# EAGLE design Optical Lick Detector (EAGLE 9.3.2)
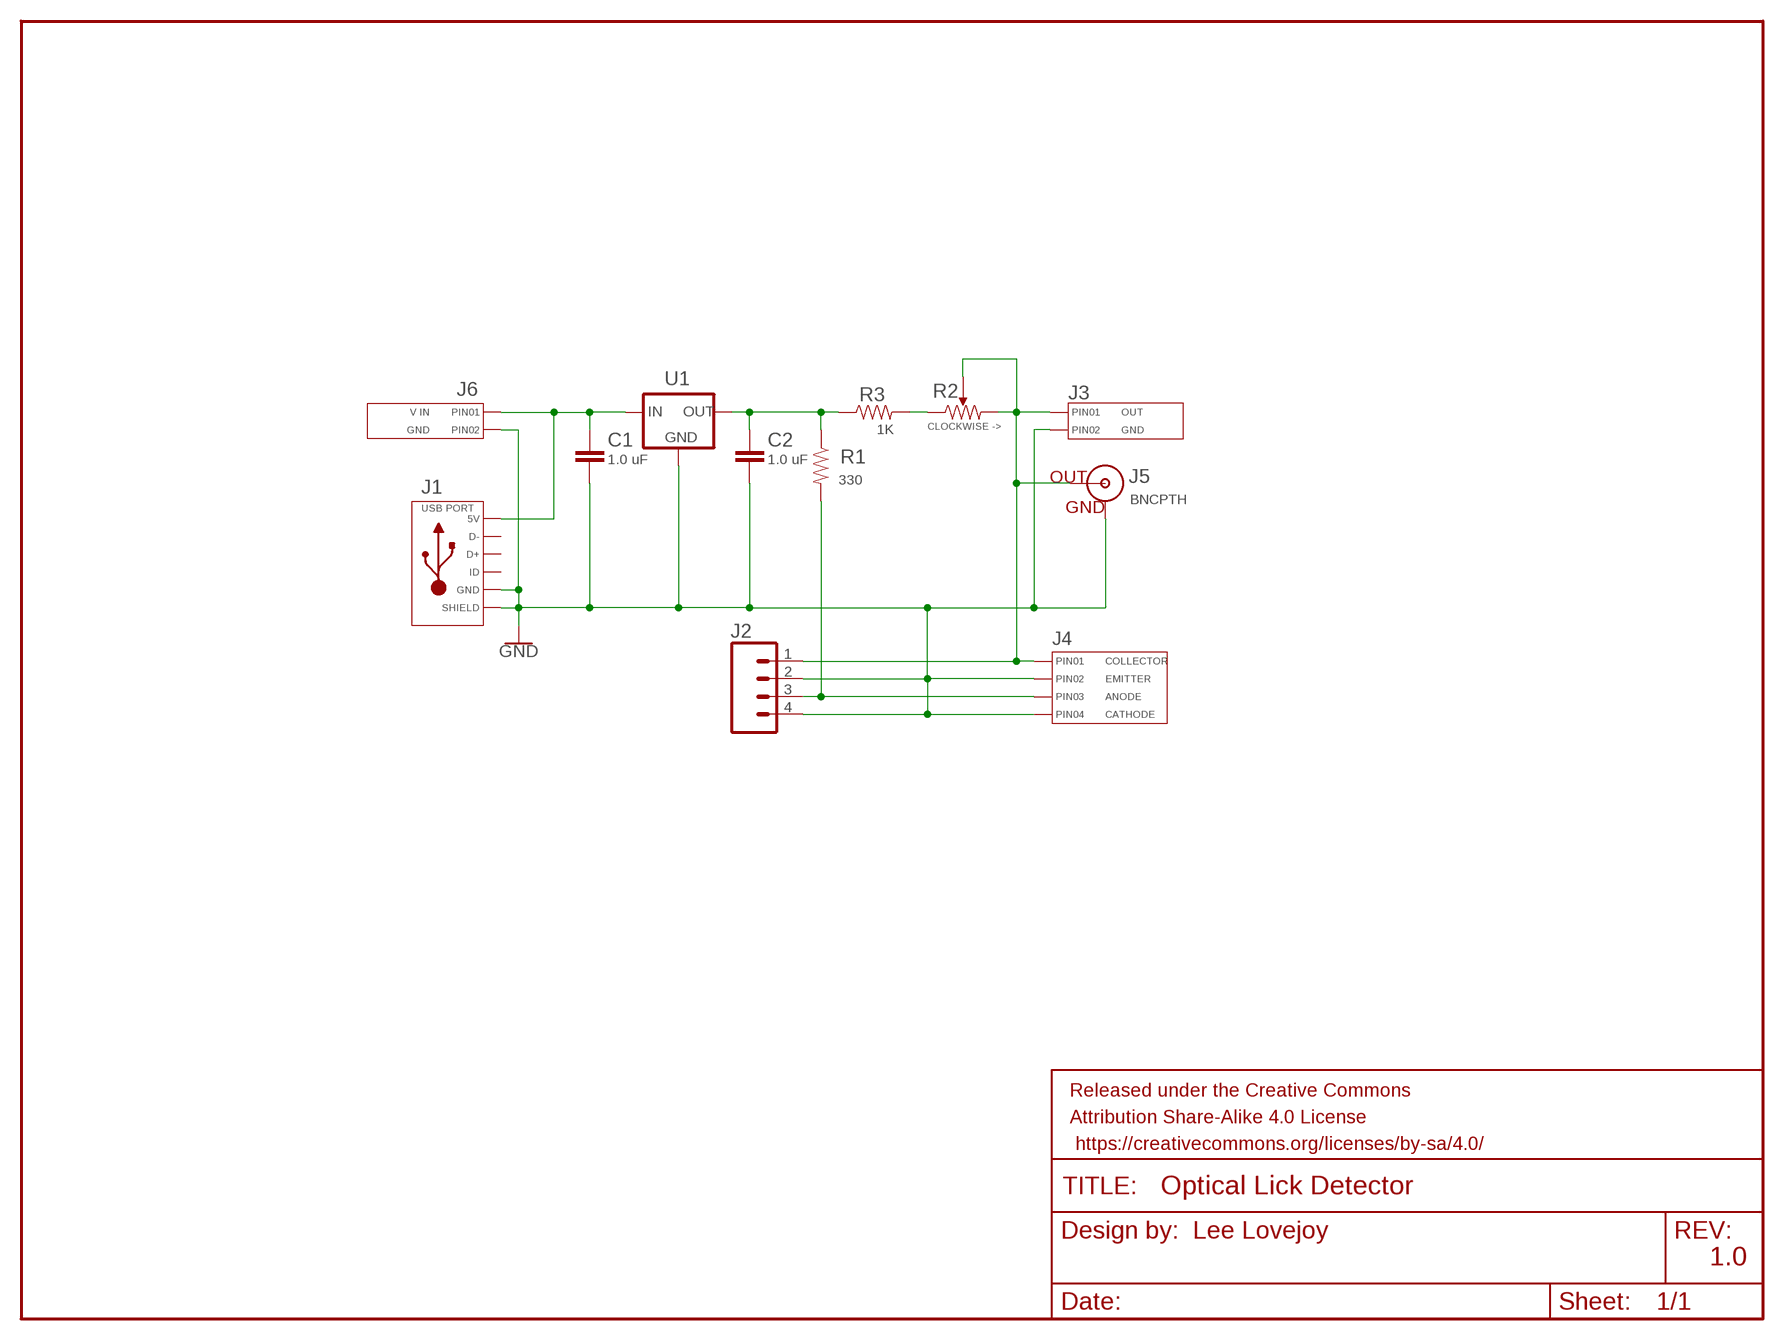
[diagram p0: schematic, sheet 1]

## Parts
C1  1.0 uF  CAPACITOR_NP_1.0UF0603  [C0603]
C2  1.0 uF  CAPACITOR_NP_1.0UF0603  [C0603]
FRAME1  FRAME-LETTER  [CREATIVE_COMMONS]
J1  MF-CON-MICROUSB-RIGHT  USB_MICRO_RIGHT  [MICROUSB-RIGHT]
J2  CONN_041X04_NO_SILK  [1X04_NO_SILK]
J3  CONN_023.5MM  [SCREWTERMINAL-3.5MM-2]
J4  CONN_04SCREW  [SCREWTERMINAL-3.5MM-4]
J5  BNCPTH  [BNC]
J6  CONN_023.5MM  [SCREWTERMINAL-3.5MM-2]
R1  330  RESISTOR_330_0402  [R0402]
R2  MF-RES-TC33X-10K  POTENTIOMETER_10K_TC33  [TC33]
R3  1K  RESISTOR_1K_0402  [R0402]
U1  MIC5200  [SOT223]

## Nets
ANODE: J2.3 J4.3(PIN3) R1.P$2
COLLECTOR: J2.1 J3.1(PIN1) J4.1(PIN1) J5.S(OUT) R2.P$2 R2.P$3
GND: C1.P$2 C2.P$2 J1.5(GND) J1.S1(SLD) J1.S2(SLD) J1.S3(SLD) J1.S4(SLD) J1.S5(SLD) J1.S6(SLD) J2.2 J2.4 J3.2(PIN2) J4.2(PIN2) J4.4(PIN4) J5.GND J6.2(PIN2) U1.2(GND) U1.4(GND)
N$1: C1.P$1 J1.1(5V) J6.1(PIN1) U1.1(IN)
N$3: C2.P$1 R1.P$1 R3.P$1 U1.3(OUT)
N$5: R2.P$1 R3.P$2
Unconnected: J1.2(D-) J1.3(D+) J1.4(ID)

## Notes on the sheet
- 1.0

## Library data of the parts
C1 C2 = Training Doors:CAPACITOR_NP_1.0UF; MPN: MF-CAP-0603-1uF; VALUE: 1.0
FRAME1 = Training Doors:FRAME-LETTER: Schematic Frame - Letter Standard 8.5x11 US Letter frame
J1 = Training Doors:USB: Library: MF_Connectors Description: 5 Pin USB Connectors. SLD is the shield connection. Usually tied to ground through a small ferrite bead.; HOUSEPART: YES; MPN: MF-CON-MICROUSB-RIGHT; POPULATE: 1; URL: https://factory.macrofab.com/part/MF-CON-MICROUSB-RIGHT
J2 = SparkFun-Connectors:CONN_04: Multi connection point. Often used as Generic Header-pin footprint for 0.1 inch spaced/style header connections On any of the 0.1 inch spaced packages, you can populate with these: Break Away Headers - Straight <https://www.sparkfun.com/products/116> (PRT-00116) Break Away Male Headers - Right Angle <https://www.sparkfun.com/products/553> (PRT-00553) Female Headers <https://www.sparkfun.com/products/115> (PRT-00115) Break Away Headers - Machine Pin <https://www.sparkfun.com/products/117> (PRT-00117) Break Away Female Headers - Swiss Machine Pin <https://www.sparkfun.com/products/743> (PRT-00743) For SCREWTERMINALS and SPRING TERMINALS visit here: Screw Terimnals on SparkFun.com <https://www.sparkfun.com/search/results?term=Screw+Terminals> (5mm/3.5mm/2.54mm spacing) This device is also useful as a general connection point to wire up your design to another part of your project. Our various solder wires solder well into these plated through hole pads. Hook-Up Wire - Assortment (Stranded, 22 AWG) <https://www.sparkfun.com/products/11375> (PRT-11375) Hook-Up Wire - Assortment (Solid Core, 22 AWG) <https://www.sparkfun.com/products/11367> (PRT-11367) View the entire wire category on our website here <https://www.sparkfun.com/categories/141> Special notes: Molex polarized connector foot print use with SKU : PRT-08231 with associated crimp pins and housings. 1MM SMD Version SKU: PRT-10208; PROD_ID: CONN-09696
J3 = Training Doors:CONN_02: Multi connection point. Often used as Generic Header-pin footprint for 0.1 inch spaced/style header connections On any of the 0.1 inch spaced packages, you can populate with these: Break Away Headers - Straight <https://www.sparkfun.com/products/116> (PRT-00116) Break Away Male Headers - Right Angle <https://www.sparkfun.com/products/553> (PRT-00553) Female Headers <https://www.sparkfun.com/products/115> (PRT-00115) Break Away Headers - Machine Pin <https://www.sparkfun.com/products/117> (PRT-00117) Break Away Female Headers - Swiss Machine Pin <https://www.sparkfun.com/products/743> (PRT-00743) For SCREWTERMINALS and SPRING TERMINALS visit here: Screw Terimnals on SparkFun.com <https://www.sparkfun.com/search/results?term=Screw+Terminals> (5mm/3.5mm/2.54mm spacing) This device is also useful as a general connection point to wire up your design to another part of your project. Our various solder wires solder well into these plated through hole pads. Hook-Up Wire - Assortment (Stranded, 22 AWG) <https://www.sparkfun.com/products/11375> (PRT-11375) Hook-Up Wire - Assortment (Solid Core, 22 AWG) <https://www.sparkfun.com/products/11367> (PRT-11367) View the entire wire category on our website here <https://www.sparkfun.com/categories/141> Special notes: Molex polarized connector foot print use with: PRT-08233 with associated crimp pins and housings. 2.54_SCREWTERM for use with PRT-10571. 3.5mm Screw Terminal footprints for PRT-08084 5mm Screw Terminal footprints for use with PRT-08432; LABEL01: OUT; LABEL02: GND; MPN: 0393570002; PROD_ID: CONN-08399
J4 = Training Doors:CONN_04: Multi connection point. Often used as Generic Header-pin footprint for 0.1 inch spaced/style header connections On any of the 0.1 inch spaced packages, you can populate with these: Break Away Headers - Straight <https://www.sparkfun.com/products/116> (PRT-00116) Break Away Male Headers - Right Angle <https://www.sparkfun.com/products/553> (PRT-00553) Female Headers <https://www.sparkfun.com/products/115> (PRT-00115) Break Away Headers - Machine Pin <https://www.sparkfun.com/products/117> (PRT-00117) Break Away Female Headers - Swiss Machine Pin <https://www.sparkfun.com/products/743> (PRT-00743) For SCREWTERMINALS and SPRING TERMINALS visit here: Screw Terimnals on SparkFun.com <https://www.sparkfun.com/search/results?term=Screw+Terminals> (5mm/3.5mm/2.54mm spacing) This device is also useful as a general connection point to wire up your design to another part of your project. Our various solder wires solder well into these plated through hole pads. Hook-Up Wire - Assortment (Stranded, 22 AWG) <https://www.sparkfun.com/products/11375> (PRT-11375) Hook-Up Wire - Assortment (Solid Core, 22 AWG) <https://www.sparkfun.com/products/11367> (PRT-11367) View the entire wire category on our website here <https://www.sparkfun.com/categories/141> Special notes: Molex polarized connector foot print use with SKU : PRT-08231 with associated crimp pins and housings. 1MM SMD Version SKU: PRT-10208; LABEL01: COLLECTOR; LABEL02: EMITTER; LABEL03: ANODE; LABEL04: CATHODE; PROD_ID: 2xCONN-08399; SF_ID: 2xPRT-08084
J5 = SparkFun-Connectors:BNC: BNC Right Angle Connector Mouser Part# 5227161 SparkFun Products: BNC Connector - Right Angle <https://www.sparkfun.com/products/10550>; PROD_ID: LPA-12729; SF_ID: PRT-10550
J6 = Training Doors:CONN_02: Multi connection point. Often used as Generic Header-pin footprint for 0.1 inch spaced/style header connections On any of the 0.1 inch spaced packages, you can populate with these: Break Away Headers - Straight <https://www.sparkfun.com/products/116> (PRT-00116) Break Away Male Headers - Right Angle <https://www.sparkfun.com/products/553> (PRT-00553) Female Headers <https://www.sparkfun.com/products/115> (PRT-00115) Break Away Headers - Machine Pin <https://www.sparkfun.com/products/117> (PRT-00117) Break Away Female Headers - Swiss Machine Pin <https://www.sparkfun.com/products/743> (PRT-00743) For SCREWTERMINALS and SPRING TERMINALS visit here: Screw Terimnals on SparkFun.com <https://www.sparkfun.com/search/results?term=Screw+Terminals> (5mm/3.5mm/2.54mm spacing) This device is also useful as a general connection point to wire up your design to another part of your project. Our various solder wires solder well into these plated through hole pads. Hook-Up Wire - Assortment (Stranded, 22 AWG) <https://www.sparkfun.com/products/11375> (PRT-11375) Hook-Up Wire - Assortment (Solid Core, 22 AWG) <https://www.sparkfun.com/products/11367> (PRT-11367) View the entire wire category on our website here <https://www.sparkfun.com/categories/141> Special notes: Molex polarized connector foot print use with: PRT-08233 with associated crimp pins and housings. 2.54_SCREWTERM for use with PRT-10571. 3.5mm Screw Terminal footprints for PRT-08084 5mm Screw Terminal footprints for use with PRT-08432; LABEL01: V IN; LABEL02: GND; MPN: 0393570002; PROD_ID: CONN-08399
R1 = Training Doors:RESISTOR_330: Library: MF_Passives Description: Device for Resistors. Manufacture part number (MPN), Voltage, Tolerance, and Wattage Rating can be added via Attributes. Check https://factory.macrofab.com/parts for the house parts list.; HOUSEPART: yes; MPN: MF-RES-0402-330; POPULATE: 1; URL: https://factory.macrofab.com/part/MF-RES-0402-330
R2 = MF_Passives:POTENTIOMETER: Library: MF_Passives Description: Device for Potentiometers. Manufacture part number (MPN) can be added via Attributes. Check https://factory.macrofab.com/parts for the house parts list.; HOUSEPART: YES; MPN: MF-RES-TC33X-10K; POPULATE: 1; TOLERANCE: 25%; URL: https://factory.macrofab.com/part/MF-RES-TC33X-10K; WATTAGE: 100mW
R3 = Training Doors:RESISTOR_1K: Library: MF_Passives Description: Device for Resistors. Manufacture part number (MPN), Voltage, Tolerance, and Wattage Rating can be added via Attributes. Check https://factory.macrofab.com/parts for the house parts list.; HOUSEPART: yes; MPN: MF-RES-0402-1K; POPULATE: 1
U1 = Training Doors:MIC5200

## Board
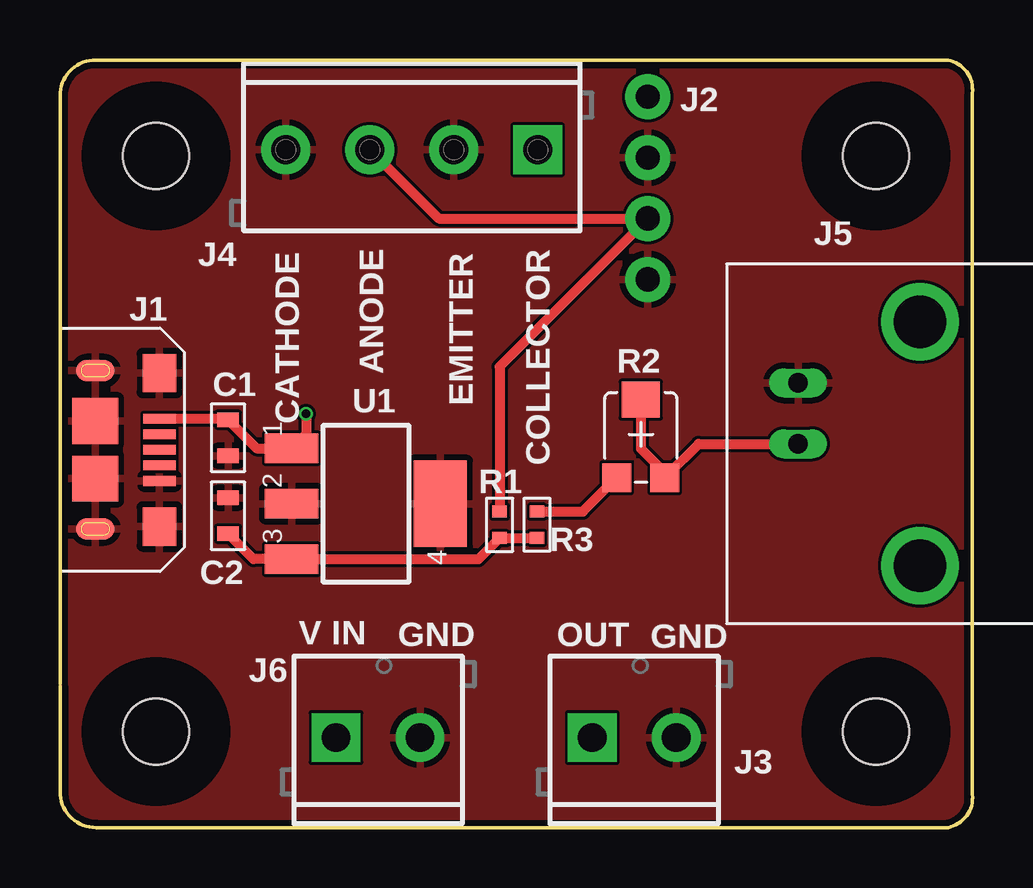
[diagram p1: board, top side]
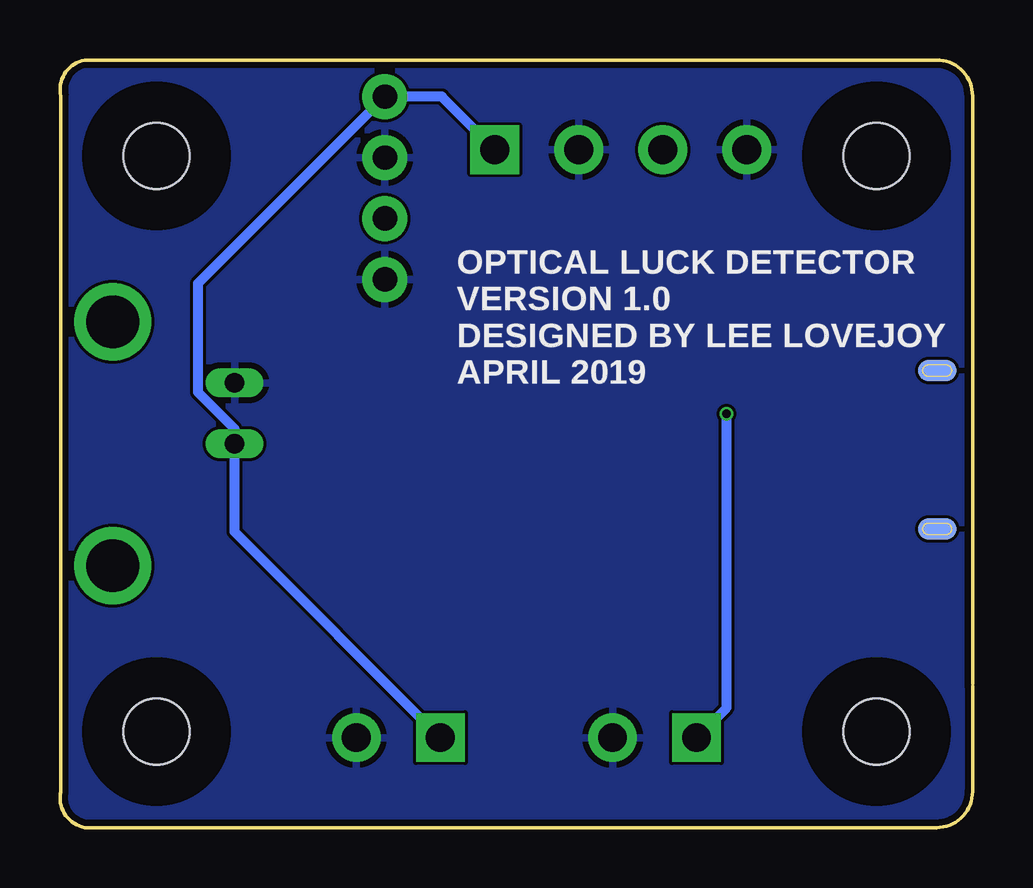
[diagram p2: board, bottom side, seen from below]

Size 38.02 x 32 mm. Coordinates in mm from the lower left corner, seen from the top.
Outline: 0,6 0,30.5 arc-90 1.5,32 37,32 arc-90 38,30.5 38,1.5 arc-90 37,0 1.5,0 arc-90 0,1.5 0,5.9
Copper layers (1*16): Top 0.035mm / dielectric 1.5mm / Bottom 0.035mm
Design rules "MF_Standard_2_Layer": minimum track width 5mil, minimum drill 10mil, track to track 5mil, track to pad 5mil, pad to pad 5mil, via to via 5mil, smd to smd 0mil, copper to edge 10mil, drill to drill 10mil, minimum pad ring 4mil, minimum via ring 4mil, stop-mask expansion 2mil, vias tented up to drill 25mil, thermal gap 10mil
Holes 2.75 mm at 4,28 4,4 34,28 34,4
tRestrict: area 0.9,24.9 to 7.1,31.1; area 0.9,0.9 to 7.1,7.1; area 30.9,24.9 to 37.1,31.1; area 30.9,0.9 to 37.1,7.1
bRestrict: area 0.9,24.9 to 7.1,31.1; area 0.9,0.9 to 7.1,7.1; area 30.9,24.9 to 37.1,31.1; area 30.9,0.9 to 37.1,7.1

### Footprints (pad centres in the part's own frame; a part is rotated, then mirrored left to right if it is on the bottom)
C0603 = smd 0.6 x 0.9: P$1 -0.75,0; P$2 0.75,0
MICROUSB-RIGHT = smd 0.4 x 1.35: 1 -1.3,1.27; 2 -0.65,1.27; 3 0,1.27; 4 0.65,1.27; 5 1.3,1.27 | smd 0.9 x 1.6: S1 -3.3,-1.4; S2 3.3,-1.4 | smd 1.6 x 1.4: S3 -3.2,1.27; S4 3.2,1.27 | smd 1.9 x 1.9: S5 -1.2,-1.405; S6 1.2,-1.405 | smd 0.9 x 1.6 bottom: S7 -3.3,-1.4; S8 3.3,-1.4
1X04_NO_SILK = drill 1.016 pad 1.88: 1 0,0; 2 2.54,0; 3 5.08,0; 4 7.62,0
SCREWTERMINAL-3.5MM-2 = drill 1.2 pad 2.032 square: 1 0,0 | drill 1.2 pad 2.032: 2 3.5,0
SCREWTERMINAL-3.5MM-4 = drill 1.2 pad 2.032 square: 1 0,13.97 | drill 1.2 pad 2.032: 2 3.5,13.97; 3 7,13.97; 4 10.5,13.97
BNC = drill 2.2: 3 -5.08,5.08; 4 5.08,5.08 | drill 0.8 long: GND -2.54,0; S 0,0
R0402 = smd 0.5 x 0.6: P$1 -0.55,0; P$2 0.55,0
TC33 = smd 1.2 x 1.2: P$1 -1.8,1; P$3 -1.8,-1 | smd 1.5 x 1.6: P$2 1.45,0
SOT223 = smd 1.219 x 2.235: 1 -2.311,-3.099; 2 0,-3.099; 3 2.311,-3.099 | smd 3.6 x 2.2: 4 0,3.099

### Placement (x,y rotation side)
C1  7,16.25 270 top
C2  7,13 90 top
FRAME1  19,-10.25 0 top  (outside the outline)
J1  2.88,15.75 270 top
J2  24.49,30.47 270 top
J3  22.18,3.75 0 top
J4  19.91,42.23 180 top
J5  30.75,16 270 top
J6  11.5,3.75 0 top
R1  18.32,12.62 90 top
R2  24.2,16.39 90 top
R3  19.88,12.62 90 top
U1  12.75,13.5 270 top

### Tracks (layer width: path | path; a pad name or v marks a point on that pad's centre or on a via)
ANODE
  Top 0.406: J4.3 15.79,25.39 J2.3 18.32,19.22 R1.P$2
COLLECTOR
  Top 0.406: R2.P$3 25.31,14.69 | 25.31,14.69 26.61,16 J5.S | R2.P$2 24.2,15.8 25.31,14.69
  Bottom 0.406: J3.1 30.75,12.32 J5.S 30.75,16.62 32.28,18.16 32.28,22.68 J2.1 22.11,30.47 J4.1
GND
  pour Bottom: -1.32,32.51 -1.32,0.49 -0.32,-0.51 38.05,-0.51 38.32,-0.51 39.32,0.49 39.32,32.51
  pour Top: -2.59,33.78 -2.59,-0.78 -1.59,-1.78 -0.05,-1.78 39.59,-1.78 40.59,-0.78 40.59,-0.51 40.59,32.51 40.59,32.78 39.59,33.78
N$1  (via drill 0.35)
  Top 0.406: J1.1 6.95,17.05 C1.P$1 8.19,15.81 U1.1 10.25,16.41 v10.25,17.25
  Bottom 0.406: J6.1 10.25,5 v10.25,17.25
N$3
  Top 0.406: C2.P$1 8.06,11.19 U1.3 17.44,11.19 R1.P$1 19.87,12.07 R3.P$1
N$5
  Top 0.406: R3.P$2 21.79,13.18 R2.P$1

### Text on the board
bPlace: OPTICAL LUCK DETECTOR / VERSION 1.0 / DESIGNED BY LEE LOVEJOY / APRIL 2019